# Altium project BaseMod.PrjPCB (part 4 of 4)

## Sheet Input_channel.SchDoc: ADC input
size 420 x 297 mm; EDA_Number: ARTIQ; Projet: Sampler; Author: G.Kasprowicz; CompanyName: WUT ISE; DrawnBy: G.Kasprowicz; Organization: WUT ISE; Address1: PW ISE; Address2: Nowowiejska 15/19 00-665 Warsaw; Address3: gkasprow@gmail.com; DocumentNumber: 2; Revision: 1.0; SheetNumber: 2; SheetTotal: 7; ModifiedBy: -; CheckedDate: -; Title2: front end; DivGrp: WUT ISE; Designer: G.Kasprowicz; ModifiedDate: -; ProjectName: Sensor Box
Used 4 times, as channels U_Input_channel0, U_Input_channel1, U_Input_channel2, U_Input_channel3. Parts and nets are listed once, with the designators drawn on the sheet.
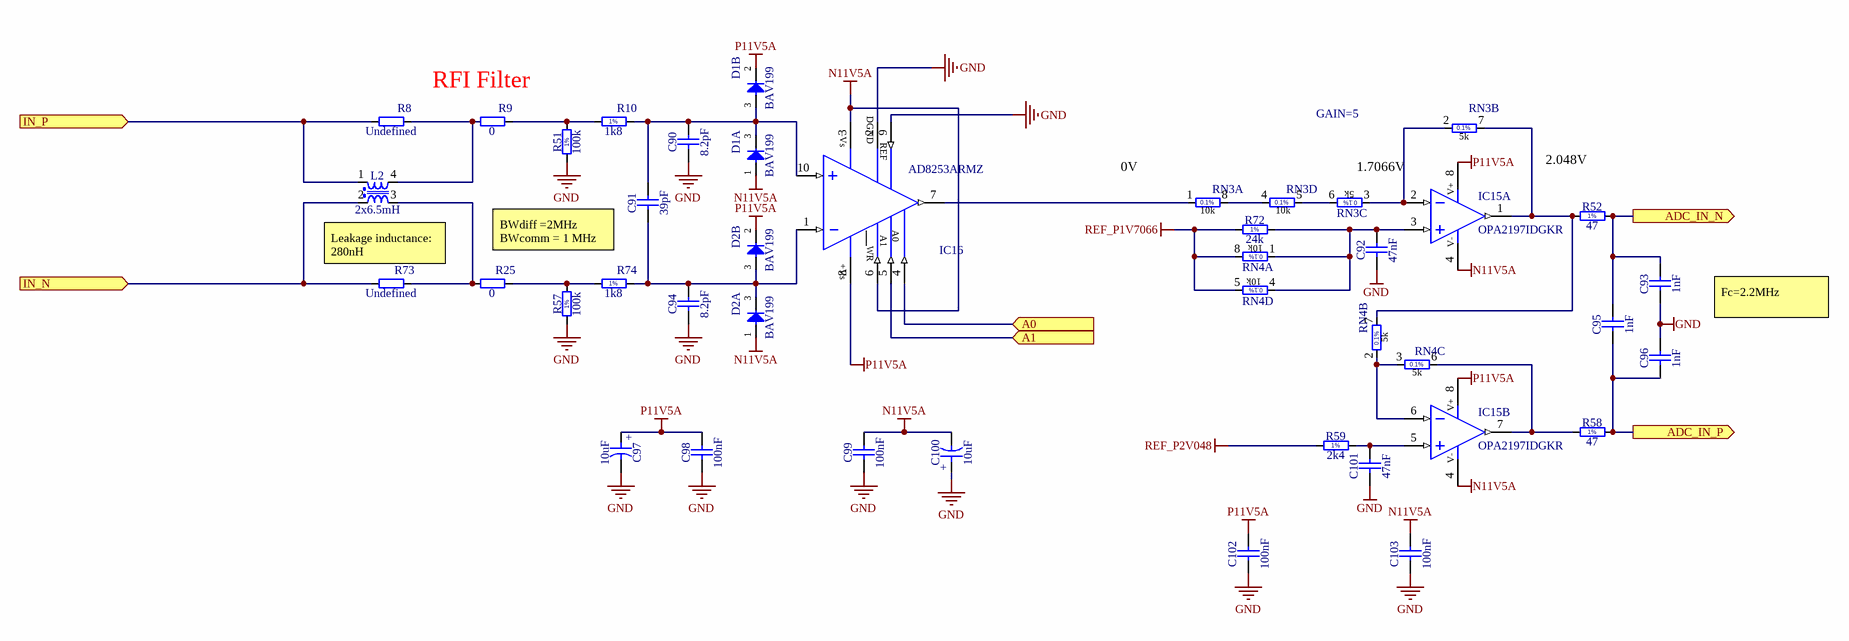
[diagram p6: Input_channel.SchDoc]

### Parts
C90  8.2pF  [CAPC1608X87N]
C91  39pF  [CAPC1608X87N]
C92  47nF  [CAPC2012X135N]
C93  1nF  [CAPC1608X90N]
C94  8.2pF  [CAPC1608X87N]
C95  1nF  [CAPC1608X90N]
C96  1nF  [CAPC1608X90N]
C97  10uF  [CAPMP3216X180N]
C98  100nF  [CAPC1005X55N]
C99  100nF  [CAPC1005X55N]
C100  10uF  [CAPMP3216X180N]
C101  47nF  [CAPC2012X135N]
C102  100nF  [CAPC1005X55N]
C103  100nF  [CAPC1005X55N]
D1  BAV199  [SOT95P240X110-3N]  (parts A,B of 2)
D2  BAV199  [SOT95P240X110-3N]  (parts A,B of 2)
IC15  OPA2197IDGKR  [SOP65P490X110-8N]  (parts A,B of 2)
IC16  AD8253ARMZ  [SOP50P490X110-10N]
L2  2x6.5mH  [IND_WURTH_WE-SL2]
R8  Undefined  [RESC1608X55N]
R9  0  [RESC1608X55N]
R10  1k8  [RESC1608X55N]
R25  0  [RESC1608X55N]
R51  100k  [RESC1608X55N]
R52  47  [RESC1005X40N]
R57  100k  [RESC1608X55N]
R58  47  [RESC1005X40N]
R59  2k4  [RESC1005X40N]
R72  24k  [RESC1608X55N]
R73  Undefined  [RESC1608X55N]
R74  1k8  [RESC1608X55N]
RN3  10k 5K 5K 10K  [SOIC127P600X175-8N]  (value not drawn)  (parts A,B,C,D of 4)
RN4  10k 5K 5K 10K  [SOIC127P600X175-8N]  (value not drawn)  (parts A,B,C,D of 4)

### Ports
A0 (in), A1 (in), ADC_IN_N (out), ADC_IN_P (out), IN_N (in), IN_P (in)

### Nets
GND: C90.1 C92.1 C93.1 C94.1 C96.2 C97.2 C98.1 C99.1 C100.1 C101.1 C102.1 C103.1 IC16.2(DGND) IC16.9(REF) R51.1 R57.1
N11V5A: C99.2 C100.2 C103.2 D1.1(A) D2.1(A) IC15.4(V-) IC16.3(-VS) IC16.6(~{WR})
P11V5A: C97.1 C98.2 C102.2 D1.2(C) D2.2(C) IC15.8(V+) IC16.8(+VS)
REF_P1V7066: R72.1 RN4.5 RN4.8
REF_P2V048: R59.1
A0: IC16.4(A0) ; port A0
A1: IC16.5(A1) ; port A1
ADC_IN_N: C93.2 C95.2 R52.2 ; port ADC_IN_N
ADC_IN_P: C95.1 C96.1 R58.2 ; port ADC_IN_P
IN_N: L2.2 R73.1 ; port IN_N
IN_P: L2.1 R8.1 ; port IN_P
NetC90_2: C90.2 C91.2 D1.3(COMAC) IC16.10(+IN) R10.2
NetC91_1: C91.1 C94.2 D2.3(COMAC) IC16.1(-IN) R74.2
NetC92_2: C92.2 IC15.3(IN+) R72.2 RN4.1 RN4.4
NetC101_2: C101.2 IC15.5(IN+) R59.2
NetIC15_1: IC15.1(OUT) R52.1 RN3.7 RN4.7
NetIC15_2: IC15.2(IN-) RN3.2 RN3.3
NetIC15_6: IC15.6(IN-) RN4.2 RN4.3
NetIC15_7: IC15.7(OUT) R58.1 RN4.6
NetIC16_7: IC16.7(OUT) RN3.1
NetL2_3: L2.3 R25.1 R73.2
NetL2_4: L2.4 R8.2 R9.1
NetR9_2: R9.2 R10.1 R51.2
NetR25_2: R25.2 R57.2 R74.1
NetRN3_4: RN3.4 RN3.8
NetRN3_5: RN3.5 RN3.6

### Channels
U_Input_channel0: designators end in A; ports A0=CH3_A0 A1=CH3_A1 ADC_IN_N=IN_3_N ADC_IN_P=IN_3_P IN_N=ADC3_G IN_P=ADC3
U_Input_channel1: designators end in B; ports A0=CH2_A0 A1=CH2_A1 ADC_IN_N=IN_2_N ADC_IN_P=IN_2_P IN_N=ADC2_G IN_P=ADC2
U_Input_channel2: designators end in C; ports A0=CH1_A0 A1=CH1_A1 ADC_IN_N=IN_1_N ADC_IN_P=IN_1_P IN_N=ADC1_G IN_P=ADC1
U_Input_channel3: designators end in D; ports A0=CH0_A0 A1=CH0_A1 ADC_IN_N=IN_0_N ADC_IN_P=IN_0_P IN_N=ADC0_G IN_P=ADC0

### Notes on the sheet
- RFI Filter
- GAIN=5
- 0V
- 1.7066V
- 2.048V
- Leakage inductance: 280nH
- BWdiff =2MHz
  BWcomm = 1 MHz
- Fc=2.2MHz
- Project/Equipment
- Document
- Designer
- Drawn by
- Check.by
- Copyright WUT ISE 2018.
  This documentation describes Open Hardware and is licensed under the CERN OHL v.1.1. You may redistribute and modify this documentation under the terms of the CERN OHL v.1.1. (http://ohwr.org/CERNOHL). This documentation is distributed WITHOUT ANY EXPRESS OR IMPLIED WARRANTY, INCLUDING OF MERCHANTABILITY, SATISFACTORY QUALITY AND FITNESS FOR A PARTICULAR PURPOSE. Please see the CERN OHL v.1.1 for applicable conditions.
- Contact
- File
- Last Mod.
- Print Date
- Sheet
- Size
- A3
- of
- Rev
- (in symbol AD8253ARMZ) -Vs; WR; +Vs
- (in symbol CTE3216-18_10UF_16V_20%_AVX_TCJ) +
- (in symbol R0402_2K4_1%_0.0625W_100PPM) 1%
- (in symbol R0402_47R_1%_0.0625W_100PPM) 1%
- (in symbol R0603_1K8_1%_0.1W_100PPM) 1%
- (in symbol R0603_24K_1%_0.1W_100PPM) 1%
- (in symbol R0603_100K_1%_0.1W_100PPM) 1%
- (in symbol RN_10K_5K_VISHAY_AORN2-1AT3, part A) 10k
- (in symbol RN_10K_5K_VISHAY_AORN2-1AT3, part B) 5k
- (in symbol RN_10K_5K_VISHAY_AORN2-1AT3, part C) 5k
- (in symbol RN_10K_5K_VISHAY_AORN2-1AT3, part D) 10k

### Library data of the parts
C90 C94 = CC0603_8.2PF_50V_0.5PF_NP0: Non-polarised capacitor; Part Description: SMD Multilayer Chip Ceramic Capacitor; Manufacturer: GENERIC; Manufacturer1 Part Number: 223886715828; Voltage: 50V; TC: C0G/NP0; Tolerance: ±0.5pF; Part Number: CC0603_8.2PF_50V_0.5PF_NP0; Component Kind: Standard; Component Type: Standard; Pin Count: 2; Value: 8.2pF; Status: Preferred; Manufacturer Part Number: CC0603_8.2PF_50V_0.5PF_NP0; Case: 0603; Mounted: Yes; Socket: No; SMD: Yes; Sense: No; Manufacturer1 Example: PHYCOMP; Manufacturer1 ComponentHeight: 0.87mm; HelpURL: \\cern.ch\dfs\Applications\Altium\Datasheets\CC0603_NP0_PHYCOMP.pdf; Author: CERN DEM JLC; CreateDate: 03.12.2007; LatestRevisionDate: 03.12.2007
C91 = CC0603_39PF_50V_5%_NP0: Non-polarised capacitor; Part Description: SMD Multilayer Chip Ceramic Capacitor; Manufacturer: GENERIC; Manufacturer1 Part Number: 223886715399; Voltage: 50V; TC: C0G/NP0; Tolerance: ±5%; Part Number: CC0603_39PF_50V_5%_NP0; Component Kind: Standard; Component Type: Standard; Pin Count: 2; Value: 39pF; Status: Preferred; Manufacturer Part Number: CC0603_39PF_50V_5%_NP0; Case: 0603; Mounted: Yes; Socket: No; SMD: Yes; Sense: No; HelpURL: \\cern.ch\dfs\Applications\Altium\Datasheets\CC0603_NP0_PHYCOMP.pdf; Author: CERN DEM JLC; CreateDate: 03.12.2007; LatestRevisionDate: 03.12.2007; Manufacturer1 Example: PHYCOMP; Manufacturer1 ComponentHeight: 0.87mm
C92 C101 = CC0805_47NF_25V_5%_C0G: Non-polarised capacitor; Part Description: SMD Multilayer Chip Ceramic Capacitor; Manufacturer: GENERIC; Manufacturer1 Part Number: C0805C473J3GACTU; Voltage: 25V; TC: C0G/NP0; Tolerance: ±5%; Part Number: CC0805_47NF_25V_5%_C0G; Component Kind: Standard; Component Type: Standard; Pin Count: 2; Value: 47nF; Status: None; Manufacturer Part Number: CC0805_47NF_25V_5%_C0G; Case: 0805; Mounted: Yes; Socket: No; SMD: Yes; Sense: No; Manufacturer1 Example: KEMET; Manufacturer1 ComponentHeight: 1.4mm; HelpURL: \\cern.ch\dfs\Applications\Altium\Datasheets\CC0805_C0G_KEMET_(Commercial Grade).pdf; Author: CERN DEM JLC; CreateDate: 18.01.2011; LatestRevisionDate: 18.01.2011
C93 C95 C96 = CC0603_1NF_50V_1%_NP0: Non-polarised capacitor; Part Description: SMD Multilayer Chip Ceramic Capacitor; Manufacturer: GENERIC; Manufacturer1 Part Number: 06035A102FAT2A; Voltage: 50V; TC: C0G/NP0; Tolerance: ±1%; Part Number: CC0603_1NF_50V_1%_NP0; Component Kind: Standard; Component Type: Standard; Pin Count: 2; Value: 1nF; Status: None; Manufacturer Part Number: CC0603_1NF_50V_1%_NP0; Case: 0603; Mounted: Yes; Socket: No; SMD: Yes; Sense: No; Manufacturer1 Example: AVX; Manufacturer1 ComponentHeight: 0.9mm; HelpURL: \\cern.ch\dfs\Applications\Altium\Datasheets\CC0603_C0G_AVX.pdf; Author: CERN DEM JLC; CreateDate: 15.06.2017; LatestRevisionDate: 15.06.2017
C97 C100 = CTE3216-18_10UF_16V_20%_AVX_TCJ: Polarised capacitor; Part Description: ESR 0R200 Tantalum Solid Electrolytic Chip Capacitor with Conductive Polymer Electrode; Manufacturer: AVX; Manufacturer Part Number: TCJA106M016R0200; Voltage: 16V; Tolerance: ±20%; Part Number: CTE3216-18_10UF_16V_20%_AVX_TCJ; Component Kind: Standard; Component Type: Standard; Pin Count: 2; Value: 10uF; Status: Preferred; Case: A; Mounted: Yes; Socket: No; SMD: Yes; Sense: No; ComponentHeight: 1.8mm; HelpURL: \\cern.ch\dfs\Applications\Altium\Datasheets\CTE_AVX_TCJ.pdf; Author: CERN DEM JLC; CreateDate: 29.03.2012; LatestRevisionDate: 29.03.2012
C98 C99 C102 C103 = CC0402_100NF_16V_10%_X7R: Non-polarised capacitor; Part Description: SMD Multilayer Chip Ceramic Capacitor; Manufacturer: GENERIC; Manufacturer1 Part Number: GRM155R71C104KA88D; Voltage: 16V; TC: X7R; Tolerance: ±10%; Part Number: CC0402_100NF_16V_10%_X7R; Component Kind: Standard; Component Type: Standard; Pin Count: 2; Value: 100nF; Status: Not Recommended; Manufacturer Part Number: CC0402_100NF_16V_10%_X7R; Case: 0402; Mounted: Yes; Socket: No; SMD: Yes; Sense: No; Manufacturer1 Example: MURATA; Manufacturer1 ComponentHeight: 0.55mm; HelpURL: \\cern.ch\dfs\Applications\Altium\Datasheets\CC0402_X7R_MURATA_GRM.pdf; Author: CERN DEM JLC; CreateDate: 2013-12-05; LatestRevisionDate: 2007-12-03
D1 D2 = BAV199: Serial Diode; Part Description: Low-Leakage Double Diode; Manufacturer: NXP SEMICONDUCTORS; Voltage: 75V; Power: 250mW; PressFit: No; Bonding: No; Part Number: BAV199; Component Kind: Standard; Component Type: Standard; Device: BAV199; PackageDescription: SOT23 3-Leads, Pitch 0.95mm - Body 1.4x3mm, IPC Medium Density; Manufacturer Part Number: BAV199; Pin Count: 3; Case: SOT23-3; Mounted: Yes; Socket: No; SMD: Yes; Sense: No; ComponentHeight: 1.1mm; HelpURL: \\cern.ch\dfs\Applications\Altium\Datasheets\BAV199.pdf; Author: CERN DEM JMW; CreateDate: 2008-11-21; LatestRevisionDate: 2008-11-21
IC15 = OA_OPA2197IDGKR: 36-V, Precision, Rail-to-Rail Input Output, Low Offset Voltage Op Amp 8-VSSOP; Part Description: High-Precision, Low-Noise, Rail-to-Rail Output,10-MHz Op Amp; Manufacturer: TEXAS INSTRUMENTS; PressFit: No; Bonding: No; Part Number: OPA2197IDGKR; Component Kind: Standard; Component Type: Standard; Device: OPA2197IDGKR; PackageDescription: SOP, 0.65mm pitch; 8 pin, 3.00mm W X 3.00mm L X 1.10mm H body, IPC Medium Density; Manufacturer Part Number: OPA2197IDGKR; Pin Count: 8; Case: MSOP8; Mounted: Yes; Socket: No; SMD: Yes; Sense: No; ComponentHeight: 1.1mm; Author: GK; HelpURL: \\cern.ch\dfs\Applications\Altium\Datasheets\OPA2140AIDGK.pdf; CreateDate: 20.04.2017; LatestRevisionDate: 20.04.2017
IC16 = AD8253ARMZ: 10MHz, 20V/us, G= 1, 10, 100, 1000 iCMOS Programmable Gain Instrumentation Amplifier; Manufacturer: ANALOG DEVICES; PressFit: No; Bonding: No; Part Number: AD8253ARMZ; Component Kind: Standard; Component Type: Standard; Device: AD8253ARMZ; PackageDescription: MSOP, 10-Leads, Body 3.1x3.1mm (max), Pitch 0.50mm, IPC Medium Density; Part Description: 10MHz, 20V/us, G= 1, 10, 100, 1000 iCMOS Programmable Gain Instrumentation Amplifier; Manufacturer Part Number: AD8253ARMZ; Pin Count: 8; Case: MSOP10; Mounted: Yes; Socket: No; SMD: Yes; Sense: No; ComponentHeight: 1.1mm; Author: CERN DEM JLC; HelpURL: \\cern.ch\dfs\Applications\Altium\Datasheets\AD8253ARMZ.pdf; CreateDate: 2013-10-02; LatestRevisionDate: 2013-10-02
L2 = IND_6.5MH_50%_WURTH_WE-SL2-744229: Inductor Common Mode; Part Description: Common Mode SMD Line Filter (WE-SL2 Serie); Manufacturer: WURTH ELEKTRONIK; Manufacturer Part Number: 744229; Power: 400mA; Resistance: 0.95R; Tolerance: ±50%; Part Number: IND_6.5MH_50%_WURTH_WE-SL2-744229; Component Kind: Standard; Component Type: Standard; Pin Count: 4; Value: 2x6.5mH; Status: None; Mounted: Yes; Socket: No; SMD: Yes; Sense: No; ComponentHeight: 5.3mm; HelpURL: \\cern.ch\dfs\Applications\Altium\Datasheets\IND_WURTH_WE-SL2_744229.pdf; Author: CERN DEM JLC; CreateDate: 01.10.2012; LatestRevisionDate: 15.10.2012
R8 R73 = R0603_NO-VALUE: Resistor; Part Description: Reserved Footprint For a 0603 (1608) Chip Resistor; Mounted: No; Part Number: R0603_NO-VALUE; Component Kind: Standard; Component Type: Standard; Pin Count: 2; Value: Undefined; Status: None; Manufacturer: Undefined; Manufacturer Part Number: R0603_NO-VALUE; Case: 0603; Sense: No; Socket: No; SMD: Yes; Manufacturer1 Example: Undefined; Manufacturer1 Part Number: Undefined; Manufacturer1 ComponentHeight: Undefined; HelpURL: Undefined; Author: CERN DEM JLC; CreateDate: 03.12.2007; LatestRevisionDate: 13.03.2008
R9 R25 = R0603_0R_JUMPER: Resistor; Part Description: 1A (0.05R Max DC Resistance) Zero Ohm Jumper; Manufacturer: GENERIC; Manufacturer1 Part Number: NRC06Z0; Part Number: R0603_0R_JUMPER; Component Kind: Standard; Component Type: Standard; Pin Count: 2; Value: 0; Status: Preferred; Manufacturer Part Number: R0603_0R_JUMPER; Case: 0603; Mounted: Yes; Sense: No; Socket: No; SMD: Yes; Manufacturer1 Example: NIC COMPONENT; Manufacturer1 ComponentHeight: 0.55mm; HelpURL: \\cern.ch\dfs\Applications\Altium\Datasheets\R0603_NIC_NRC.pdf; Author: CERN DEM JLC; CreateDate: 03.12.2007; LatestRevisionDate: 13.03.2008
R10 R74 = R0603_1K8_1%_0.1W_100PPM: Resistor - 1%; Part Description: General Purpose Thick Film Chip Resistor; Manufacturer: GENERIC; Manufacturer1 Part Number: NRC06F1801TRF; Power: 0.1W; TC: ±100ppm/°C; Part Number: R0603_1K8_1%_0.1W_100PPM; Component Kind: Standard; Component Type: Standard; Pin Count: 2; Value: 1k8; Status: Preferred; Tolerance: ±1%; Manufacturer Part Number: R0603_1K8_1%_0.1W_100PPM; Case: 0603; Mounted: Yes; Sense: No; Socket: No; SMD: Yes; Manufacturer1 Example: NIC COMPONENT; Manufacturer1 ComponentHeight: 0.55mm; HelpURL: \\cern.ch\dfs\Applications\Altium\Datasheets\R0603_NIC_NRC.pdf; Author: CERN DEM JLC; CreateDate: 03.12.2007; LatestRevisionDate: 13.03.2008
R51 R57 = R0603_100K_1%_0.1W_100PPM: Resistor - 1%; Part Description: General Purpose Thick Film Chip Resistor; Manufacturer: GENERIC; Manufacturer1 Part Number: NRC06F1003TRF; Power: 0.1W; TC: ±100ppm/°C; Part Number: R0603_100K_1%_0.1W_100PPM; Component Kind: Standard; Component Type: Standard; Pin Count: 2; Value: 100k; Status: Preferred; Tolerance: ±1%; Manufacturer Part Number: R0603_100K_1%_0.1W_100PPM; Case: 0603; Mounted: Yes; Sense: No; Socket: No; SMD: Yes; Manufacturer1 Example: NIC COMPONENT; Manufacturer1 ComponentHeight: 0.55mm; HelpURL: \\cern.ch\dfs\Applications\Altium\Datasheets\R0603_NIC_NRC.pdf; Author: CERN DEM JLC; CreateDate: 03.12.2007; LatestRevisionDate: 13.03.2008
R52 R58 = R0402_47R_1%_0.0625W_100PPM: Resistor - 1%; Part Description: General Purpose Thick Film Chip Resistor; Manufacturer: GENERIC; Manufacturer1 Part Number: 232270674709L; TC: ±100ppm/°C; PressFit: No; Part Number: R0402_47R_1%_0.0625W_100PPM; Component Kind: Standard; Component Type: Standard; Pin Count: 2; Value: 47; Status: Not Recommended; Power: 0.0625W; Tolerance: ±1%; Manufacturer Part Number: R0402_47R_1%_0.0625W_100PPM; Case: 0402; Mounted: Yes; Sense: No; Socket: No; SMD: Yes; Manufacturer1 Example: YAGEO PHYCOMP; Manufacturer1 ComponentHeight: 0.4mm; HelpURL: \\cern.ch\dfs\Applications\Altium\Datasheets\R0402_Phycomp_RC0402.pdf; Author: CERN DEM JLC; CreateDate: 03.12.2007; LatestRevisionDate: 17.10.2012
R59 = R0402_2K4_1%_0.0625W_100PPM: Resistor - 1%; Part Description: General Purpose Thick Film Chip Resistor; Manufacturer: GENERIC; Manufacturer1 Part Number: 232270672402L; TC: ±100ppm/°C; PressFit: No; Part Number: R0402_2K4_1%_0.0625W_100PPM; Component Kind: Standard; Component Type: Standard; Pin Count: 2; Value: 2k4; Status: Not Recommended; Power: 0.0625W; Tolerance: ±1%; Manufacturer Part Number: R0402_2K4_1%_0.0625W_100PPM; Case: 0402; Mounted: Yes; Sense: No; Socket: No; SMD: Yes; Manufacturer1 Example: YAGEO PHYCOMP; Manufacturer1 ComponentHeight: 0.4mm; HelpURL: \\cern.ch\dfs\Applications\Altium\Datasheets\R0402_Phycomp_RC0402.pdf; Author: CERN DEM JLC; CreateDate: 03.12.2007; LatestRevisionDate: 17.10.2012
R72 = R0603_24K_1%_0.1W_100PPM: Resistor - 1%; Part Description: General Purpose Thick Film Chip Resistor; Manufacturer: GENERIC; Manufacturer1 Part Number: NRC06F2402TRF; Power: 0.1W; TC: ±100ppm/°C; PressFit: No; Part Number: R0603_24K_1%_0.1W_100PPM; Component Kind: Standard; Component Type: Standard; Pin Count: 2; Value: 24k; Status: Preferred; Tolerance: ±1%; Manufacturer Part Number: R0603_24K_1%_0.1W_100PPM; Case: 0603; Mounted: Yes; Sense: No; Socket: No; SMD: Yes; Manufacturer1 Example: NIC COMPONENT; Manufacturer1 ComponentHeight: 0.55mm; HelpURL: \\cern.ch\dfs\Applications\Altium\Datasheets\R0603_NIC_NRC.pdf; Author: CERN DEM JLC; CreateDate: 03.12.2007; LatestRevisionDate: 13.03.2008
RN3 RN4 = RN_10K_5K_VISHAY_AORN2-1AT3: DIL8 Resistor Network 4 Resistors 10k-5k-5k-10k 0.1%; Part Description: Dual-In-Line Thin Film Precision Automotive Resistors Network, (4 Isolated) - AORN Series; Manufacturer: VISHAY DALE; Power: 4x0.1W; TC: ±25ppm/°C; PressFit: No; Part Number: RN_10K_5K_VISHAY_AORN2-1AT3; Component Kind: Standard; Component Type: Standard; Pin Count: 8; Value: 10k 5K 5K 10K; Sense: No; Tolerance: 0.1%; Manufacturer Part Number: AORN2-1AT3; Case: SOIC8; Mounted: Yes; Socket: No; SMD: Yes; ComponentHeight: 1.73mm; HelpURL: \\cern.ch\dfs\Applications\Altium\Datasheets\RN_VISHAY_AORN.pdf; Author: CERN DEM JLC; CreateDate: 20.02.2017; LatestRevisionDate: 20.02.2017

## Nets that join several sheets
GND: BaseMod (52 pins), SEAx_connector (298 pins), U_DAC_channel0 (71 pins), U_DAC_channel1 (71 pins), Mgmt (7 pins), U_DAC_channel2 (71 pins), U_DAC_channel3 (71 pins), PowerSupply (38 pins), ADC_4CH (38 pins), U_Input_channel0 (16 pins), U_Input_channel1 (16 pins), U_Input_channel2 (16 pins), U_Input_channel3 (16 pins)
N6V0A: BaseMod (TP9.1), SEAx_connector (J22.f27 J22.f28)
N11V5A: BaseMod (TP7.1), PowerSupply (5 pins), ADC_4CH (C88.2 IC12.4), U_Input_channel0 (8 pins), U_Input_channel1 (8 pins), U_Input_channel2 (8 pins), U_Input_channel3 (8 pins)
N12V0: SEAx_connector (J22.d32 J22.d33), PowerSupply (C59.2 IC18.2 R26.2)
P2V5: BaseMod (IC4.1 IC4.2), SEAx_connector (J22.h29), U_DAC_channel0 (L5A.2), U_DAC_channel1 (L5B.2), U_DAC_channel2 (L5C.2), U_DAC_channel3 (L5D.2), ADC_4CH (C55.2 IC24.1 L8.2)
P3V3: BaseMod (8 pins), SEAx_connector (J22.c30 J22.c31), PowerSupply (6 pins)
P3V3_MP: SEAx_connector (J22.c33), Mgmt (C43.2 C54.2 IC6.12 IC14.4)
P5V0A: U_DAC_channel0 (L3A.1 L6A.2 L7A.1), U_DAC_channel1 (L3B.1 L6B.2 L7B.1), U_DAC_channel2 (L3C.1 L6C.2 L7C.1), U_DAC_channel3 (L3D.1 L6D.2 L7D.1), PowerSupply (5 pins), ADC_4CH (10 pins)
P6V0A: BaseMod (TP8.1), SEAx_connector (J22.a28 J22.a29 J22.b28 J22.b29), PowerSupply (L9.1 R78.2)
P11V5A: BaseMod (TP6.1), PowerSupply (C31.2 D4.1 IC13.9 IC13.10), ADC_4CH (C42.2 IC12.8 R4.1), U_Input_channel0 (7 pins), U_Input_channel1 (7 pins), U_Input_channel2 (7 pins), U_Input_channel3 (7 pins)
P11V5RF: U_DAC_channel0 (C4A.2 C5A.2 R36A.1), U_DAC_channel1 (C4B.2 C5B.2 R36B.1), U_DAC_channel2 (C4C.2 C5C.2 R36C.1), U_DAC_channel3 (C4D.2 C5D.2 R36D.1), PowerSupply (C70.2 D3.1 IC10.9 IC10.10)
P12V0: SEAx_connector (J22.d29 J22.d30), PowerSupply (6 pins)
REF_P1V7066: ADC_4CH (IC12.7 R7.2 RN1.7), U_Input_channel0 (R72A.1 RN4A.5 RN4A.8), U_Input_channel1 (R72B.1 RN4B.5 RN4B.8), U_Input_channel2 (R72C.1 RN4C.5 RN4C.8), U_Input_channel3 (R72D.1 RN4D.5 RN4D.8)
REF_P2V048: ADC_4CH (IC12.1 RN1.3 RN2.6), U_Input_channel0 (R59A.1), U_Input_channel1 (R59B.1), U_Input_channel2 (R59C.1), U_Input_channel3 (R59D.1)
ADC0: BaseMod (J38.1), U_Input_channel3 (L2D.1 R8D.1)
ADC0_G: BaseMod (C73.2 C74.2 J38.2 R16.2), U_Input_channel3 (L2D.2 R73D.1)
ADC1: BaseMod (J37.1), U_Input_channel2 (L2C.1 R8C.1)
ADC1_G: BaseMod (C64.2 C65.2 J37.2 R14.2), U_Input_channel2 (L2C.2 R73C.1)
ADC2: BaseMod (J36.1), U_Input_channel1 (L2B.1 R8B.1)
ADC2_G: BaseMod (C51.2 C52.2 J36.2 R13.2), U_Input_channel1 (L2B.2 R73B.1)
ADC3: BaseMod (J33.1), U_Input_channel0 (L2A.1 R8A.1)
ADC3_G: BaseMod (C32.2 C33.2 J33.2 R11.2), U_Input_channel0 (L2A.2 R73A.1)
ADC_CLKOUT_N: SEAx_connector (J22.h35), ADC_4CH (IC1.34)
ADC_CLKOUT_P: SEAx_connector (J22.h34), ADC_4CH (IC1.33)
ADC_CNVn_N: SEAx_connector (J22.e35), ADC_4CH (IC24.4 R55.1)
ADC_CNVn_P: SEAx_connector (J22.e34), ADC_4CH (IC24.3 R55.2)
ADC_SCK_N: SEAx_connector (J22.g35), ADC_4CH (IC1.42 R5.1)
ADC_SCK_P: SEAx_connector (J22.g34), ADC_4CH (IC1.41 R5.2)
ADC_SDOA_N: SEAx_connector (J22.c35), ADC_4CH (IC1.28)
ADC_SDOA_P: SEAx_connector (J22.c34), ADC_4CH (IC1.27)
ADC_SDOB_N: SEAx_connector (J22.d35), ADC_4CH (IC1.30)
ADC_SDOB_P: SEAx_connector (J22.d34), ADC_4CH (IC1.29)
ADC_SDOC_N: SEAx_connector (J22.b34), ADC_4CH (IC1.36)
ADC_SDOC_P: SEAx_connector (J22.b33), ADC_4CH (IC1.35)
ADC_SDOD_N: SEAx_connector (J22.f35), ADC_4CH (IC1.40)
ADC_SDOD_P: SEAx_connector (J22.f34), ADC_4CH (IC1.39)
AFE_CTRL_OEn: BaseMod (IC4.22), PowerSupply (LD9.1 R31.2 T3.3)
CH0_A0: BaseMod (IC4.14), U_Input_channel3 (IC16D.4)
CH0_A0_2V5: BaseMod (IC4.10), SEAx_connector (J22.h38)
CH0_A1: BaseMod (IC4.15), U_Input_channel3 (IC16D.5)
CH0_A1_2V5: BaseMod (IC4.9), SEAx_connector (J22.h39)
CH1_A0: BaseMod (IC4.16), U_Input_channel2 (IC16C.4)
CH1_A0_2V5: BaseMod (IC4.8), SEAx_connector (J22.g38)
CH1_A1: BaseMod (IC4.17), U_Input_channel2 (IC16C.5)
CH1_A1_2V5: BaseMod (IC4.7), SEAx_connector (J22.g39)
CH2_A0: BaseMod (IC4.18), U_Input_channel1 (IC16B.4)
CH2_A0_2V5: BaseMod (IC4.6), SEAx_connector (J22.f38)
CH2_A1: BaseMod (IC4.19), U_Input_channel1 (IC16B.5)
CH2_A1_2V5: BaseMod (IC4.5), SEAx_connector (J22.f39)
CH3_A0: BaseMod (IC4.20), U_Input_channel0 (IC16A.4)
CH3_A0_2V5: BaseMod (IC4.4), SEAx_connector (J22.e38)
CH3_A1: BaseMod (IC4.21), U_Input_channel0 (IC16A.5)
CH3_A1_2V5: BaseMod (IC4.3), SEAx_connector (J22.e39)
CLK: BaseMod (TP3.1), SEAx_connector (J22.g37), U_DAC_channel0 (IC3A.21), U_DAC_channel1 (IC3B.21), U_DAC_channel2 (IC3C.21), U_DAC_channel3 (IC3D.21)
COMP0_N: SEAx_connector (J22.d39), U_DAC_channel3 (IC19D.10)
COMP0_P: SEAx_connector (J22.d38), U_DAC_channel3 (IC19D.12)
COMP1_N: SEAx_connector (J22.c39), U_DAC_channel2 (IC19C.10)
COMP1_P: SEAx_connector (J22.c38), U_DAC_channel2 (IC19C.12)
COMP2_N: SEAx_connector (J22.b39), U_DAC_channel1 (IC19B.10)
COMP2_P: SEAx_connector (J22.b38), U_DAC_channel1 (IC19B.12)
COMP3_N: SEAx_connector (J22.a39), U_DAC_channel0 (IC19A.10)
COMP3_P: SEAx_connector (J22.a38), U_DAC_channel0 (IC19A.12)
DAC0: BaseMod (J30.1), U_DAC_channel3 (C50D.2)
DAC0_OUT_N: SEAx_connector (J22.h5), U_DAC_channel0 (C46A.1)
DAC0_OUT_P: SEAx_connector (J22.h6), U_DAC_channel0 (C37A.1)
DAC1: BaseMod (J29.1), U_DAC_channel2 (C50C.2)
DAC1_OUT_N: SEAx_connector (J22.g11), U_DAC_channel1 (C46B.1)
DAC1_OUT_P: SEAx_connector (J22.g12), U_DAC_channel1 (C37B.1)
DAC2: BaseMod (J28.1), U_DAC_channel1 (C50B.2)
DAC2_OUT_N: SEAx_connector (J22.h17), U_DAC_channel2 (C46C.1)
DAC2_OUT_P: SEAx_connector (J22.h18), U_DAC_channel2 (C37C.1)
DAC3: BaseMod (J27.1), U_DAC_channel0 (C50A.2)
DAC3_OUT_N: SEAx_connector (J22.g23), U_DAC_channel3 (C46D.1)
DAC3_OUT_P: SEAx_connector (J22.g24), U_DAC_channel3 (C37D.1)
IN_0_N: ADC_4CH (IC1.1), U_Input_channel3 (C93D.2 C95D.2 R52D.2)
IN_0_P: ADC_4CH (IC1.2), U_Input_channel3 (C95D.1 C96D.1 R58D.2)
IN_1_N: ADC_4CH (IC1.4), U_Input_channel2 (C93C.2 C95C.2 R52C.2)
IN_1_P: ADC_4CH (IC1.5), U_Input_channel2 (C95C.1 C96C.1 R58C.2)
IN_2_N: ADC_4CH (IC1.10), U_Input_channel1 (C93B.2 C95B.2 R52B.2)
IN_2_P: ADC_4CH (IC1.11), U_Input_channel1 (C95B.1 C96B.1 R58B.2)
IN_3_N: ADC_4CH (IC1.13), U_Input_channel0 (C93A.2 C95A.2 R52A.2)
IN_3_P: ADC_4CH (IC1.14), U_Input_channel0 (C95A.1 C96A.1 R58A.2)
LE: BaseMod (TP4.1), SEAx_connector (J22.h37), U_DAC_channel0 (IC3A.22), U_DAC_channel1 (IC3B.22), U_DAC_channel2 (IC3C.22), U_DAC_channel3 (IC3D.22)
LED0: BaseMod (IC20.3), SEAx_connector (J22.k32)
LED1: BaseMod (IC20.4), SEAx_connector (J22.k31)
LED2: BaseMod (IC20.5), SEAx_connector (J22.j32)
LED3: BaseMod (IC20.6), SEAx_connector (J22.j31)
LED4: BaseMod (IC20.7), SEAx_connector (J22.h32)
LED5: BaseMod (IC20.8), SEAx_connector (J22.h31)
LED6: BaseMod (IC20.9), SEAx_connector (J22.a34)
LED7: BaseMod (IC20.10), SEAx_connector (J22.a33)
LO_IN_N: BaseMod (R85.1), SEAx_connector (J22.c25)
LO_IN_P: BaseMod (R85.2), SEAx_connector (J22.c26)
NetIC1_23: BaseMod (T1.3 TP25.1), ADC_4CH (IC1.23 R2.2 R84.2)
NetIC8_4: PowerSupply (5 pins), ADC_4CH (R90.2)
NetJ22_g31: BaseMod (R98.1), SEAx_connector (J22.g31)
RSTn: BaseMod (TP11.1), SEAx_connector (J22.j38), U_DAC_channel0 (IC3A.20), U_DAC_channel1 (IC3B.20), U_DAC_channel2 (IC3C.20), U_DAC_channel3 (IC3D.20)
RTM_FPGA_IO8: BaseMod (R86.1), SEAx_connector (J22.k37)
RTM_FPGA_IO11: BaseMod (R88.1), SEAx_connector (J22.c37)
RTM_FPGA_IO13: BaseMod (R56.1), SEAx_connector (J22.b36)
RTM_FPGA_IO14: BaseMod (R87.1), SEAx_connector (J22.a37)
RTM_FPGA_IO15: BaseMod (R97.1 TP24.1), SEAx_connector (J22.a36), U_DAC_channel0 (IC19A.7), U_DAC_channel1 (IC19B.7), U_DAC_channel2 (IC19C.7), U_DAC_channel3 (IC19D.7)
SCL0: BaseMod (TP1.1), SEAx_connector (J22.k35), Mgmt (IC6.1 IC14.1)
SDA0: BaseMod (TP2.1), SEAx_connector (J22.k34), Mgmt (IC6.2 IC14.3)
SIN0: BaseMod (TP23.1), SEAx_connector (J22.b37), U_DAC_channel3 (IC3D.24)
SIN1: BaseMod (TP20.1), SEAx_connector (J22.d37), U_DAC_channel2 (IC3C.24)
SIN2: BaseMod (TP17.1), SEAx_connector (J22.e37), U_DAC_channel1 (IC3B.24)
SIN3: BaseMod (TP5.1), SEAx_connector (J22.j39), U_DAC_channel0 (IC3A.24)
SOUT0: BaseMod (R56.2 TP12.1), U_DAC_channel3 (IC3D.19)
SOUT1: BaseMod (R88.2 TP21.1), U_DAC_channel2 (IC3C.19)
SOUT2: BaseMod (R87.2 TP18.1), U_DAC_channel1 (IC3B.19)
SOUT3: BaseMod (R86.2 TP15.1), U_DAC_channel0 (IC3A.19)
SW0: BaseMod (TP22.1), SEAx_connector (J22.k38), U_DAC_channel3 (IC7D.2 R20D.2)
SW1: BaseMod (TP19.1), SEAx_connector (J22.k39), U_DAC_channel2 (IC7C.2 R20C.2)
SW2: BaseMod (TP16.1), SEAx_connector (J22.j37), U_DAC_channel1 (IC7B.2 R20B.2)
SW3: BaseMod (TP14.1), SEAx_connector (J22.f37), U_DAC_channel0 (IC7A.2 R20A.2)